# EAGLE design daughterBoard (EAGLE 9.6.2)
PROJECT: This Project
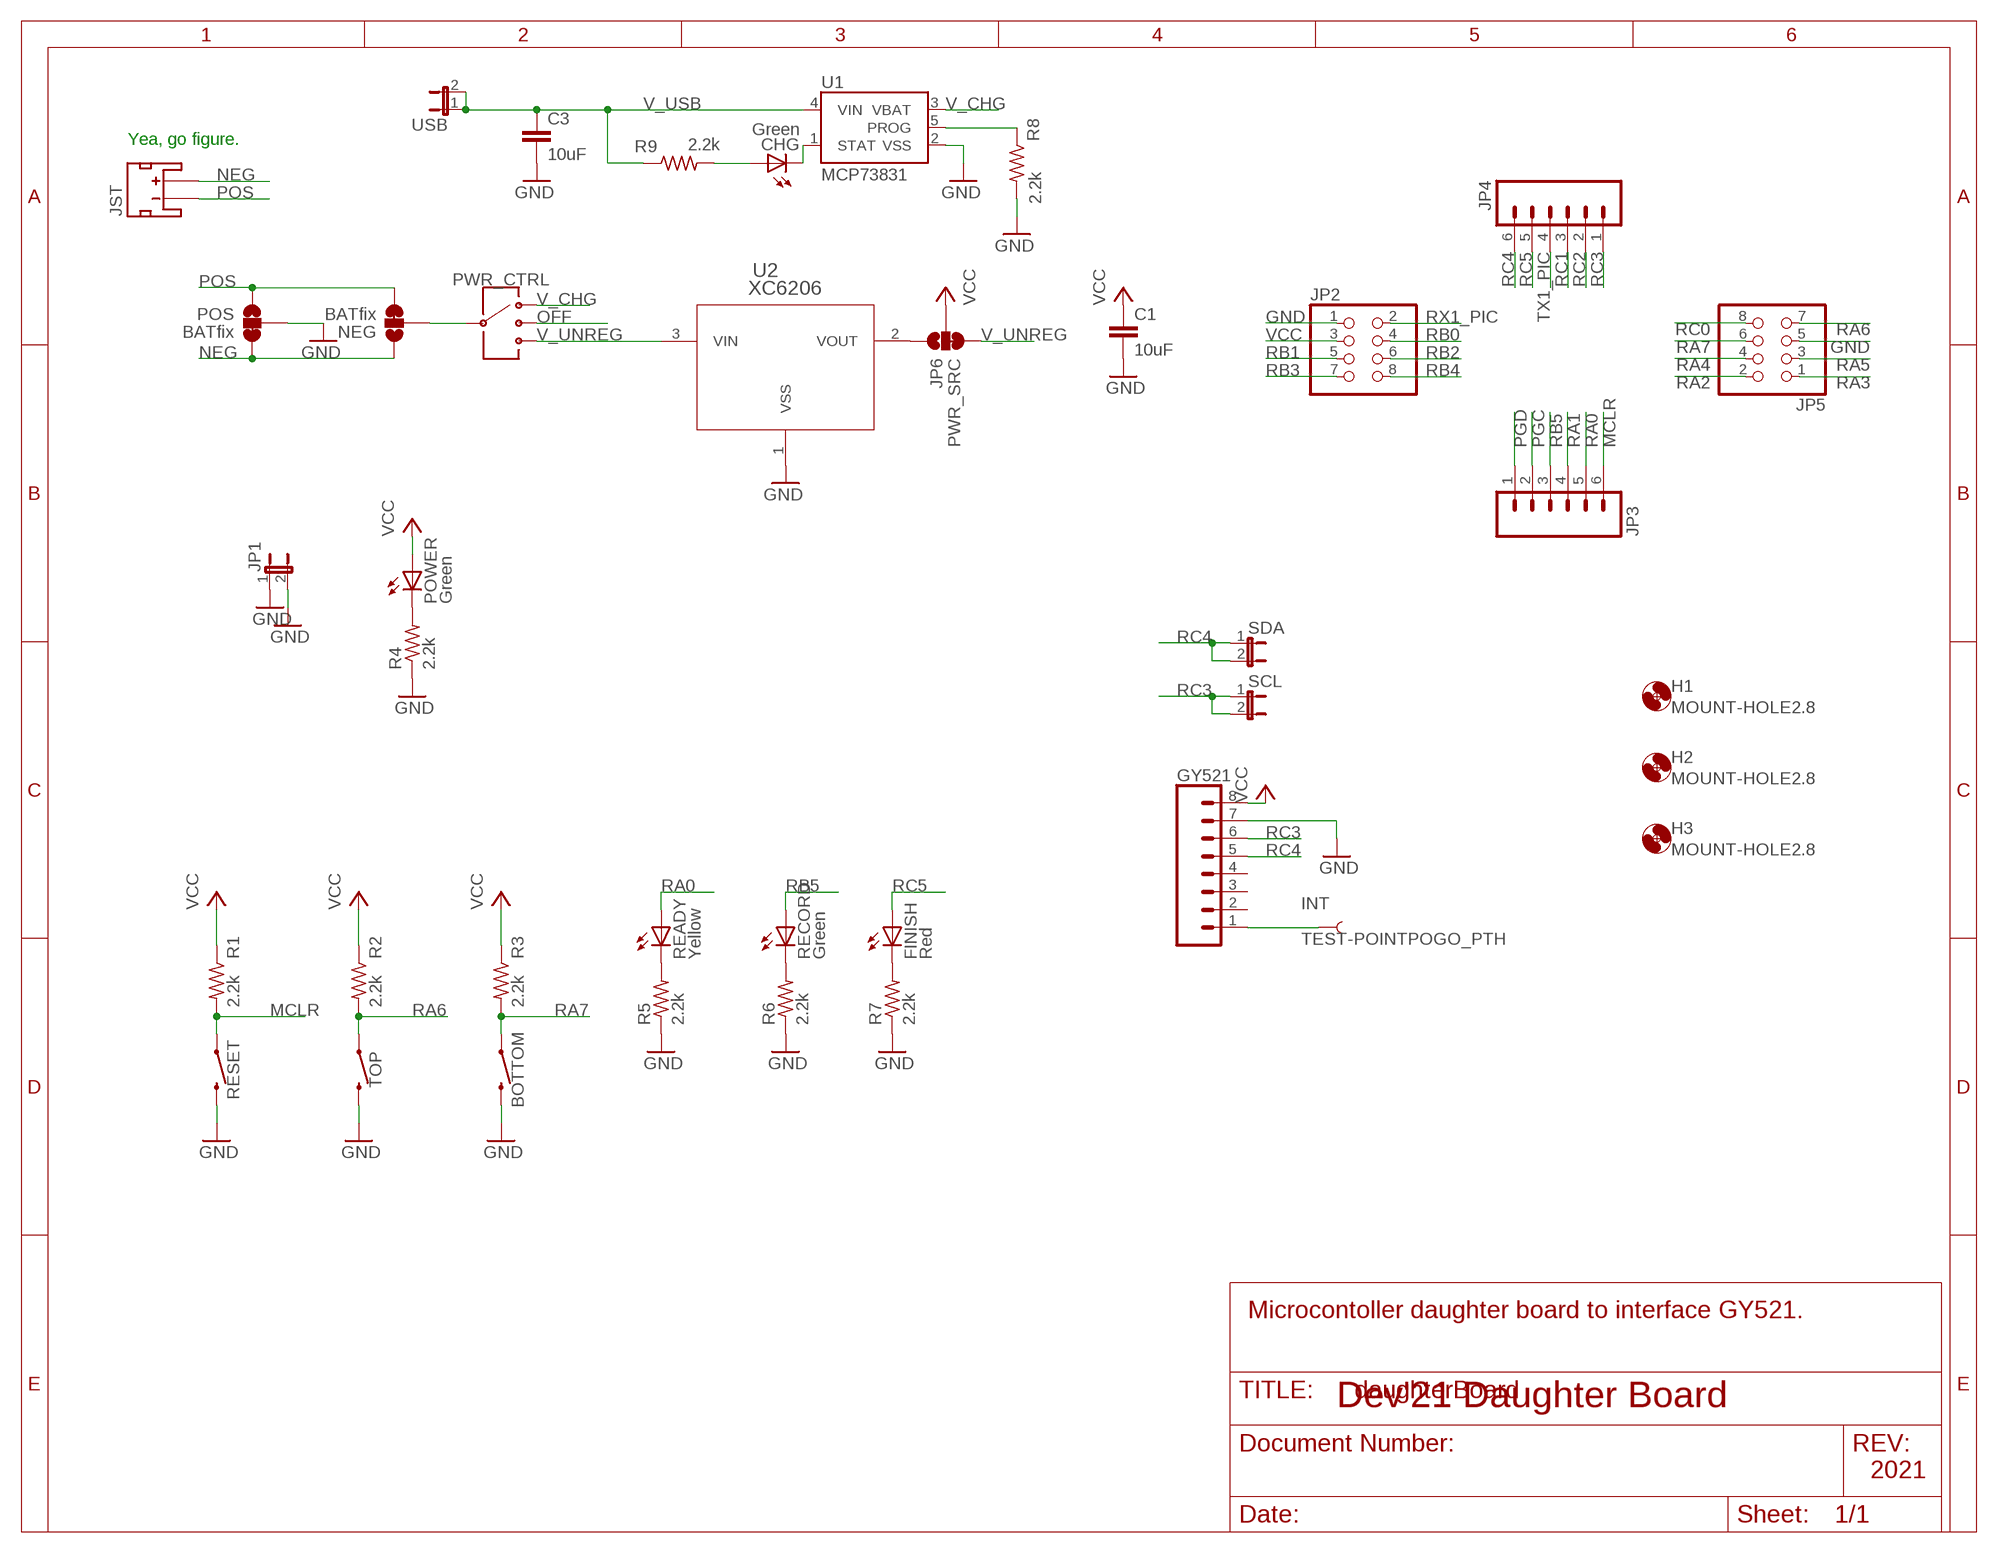
[diagram p0: schematic, sheet 1]

## Parts
BOTTOM  BOTTOM  MOMENTARY-SWITCH-SPST-SMD-5.2MM  [TACTILE_SWITCH_SMD_5.2MM]
C1  10uF  C-EUC1206  [C1206]
C3  10uF  C-EUC1206  [C1206]
CHG  Green  LED1206  [LED-1206]
FINISH  Red  LED1206  [LED-1206]
GY521  CONN_08LOCK_LONGPADS  [1X08_LOCK_LONGPADS]
H1  MOUNT-HOLE2.8  [2,8]
H2  MOUNT-HOLE2.8  [2,8]
H3  MOUNT-HOLE2.8  [2,8]
INT  TEST-POINTPOGO_PTH  [1X01_NO_SILK]
JP1  JP1E  [JP1]
JP2  PINHD-2X4  [2X04]
JP3  M06LOCK  [1X06_LOCK]
JP4  M06LOCK  [1X06_LOCK]
JP5  PINHD-2X4  [2X04]
JP6  PWR_SRC  JUMPER-SMT_3_1-NC_TRACE_SILK  [SMT-JUMPER_3_1-NC_TRACE_SILK]
JST  JST_2MM_MALE  [JST-2-SMD]
NEG  BATfix  JUMPER-SMT_3_1-NC_TRACE_SILK  [SMT-JUMPER_3_1-NC_TRACE_SILK]
POS  BATfix  JUMPER-SMT_3_1-NC_TRACE_SILK  [SMT-JUMPER_3_1-NC_TRACE_SILK]
POWER  Green  LED1206  [LED-1206]
PWR_CTRL  SWITCH-SP3T-SMD  [SWITCH_SP3T_SMD]
R1  2.2k  R-US_R1206  [R1206]
R2  2.2k  R-US_R1206  [R1206]
R3  2.2k  R-US_R1206  [R1206]
R4  2.2k  R-US_R1206  [R1206]
R5  2.2k  R-US_R1206  [R1206]
R6  2.2k  R-US_R1206  [R1206]
R7  2.2k  R-US_R1206  [R1206]
R8  2.2k  R-US_R1206  [R1206]
R9  2.2k  R-US_R1206  [R1206]
READY  Yellow  LED1206  [LED-1206]
RECORD  Green  LED1206  [LED-1206]
RESET  RESET  MOMENTARY-SWITCH-SPST-SMD-5.2MM  [TACTILE_SWITCH_SMD_5.2MM]
SCL  JUMPER-2PTH_LOCK  [1X02_LOCK]
SDA  JUMPER-2PTH_LOCK  [1X02_LOCK]
TOP  TOP  MOMENTARY-SWITCH-SPST-SMD-5.2MM  [TACTILE_SWITCH_SMD_5.2MM]
U1  MCP73831  [SOT23-5]
U2  XC6206  XC6206P332MR-GSOT-23_TOR-M  [SOT-23_TOR-M]
USB  JUMPER-2PTH_LOCK  [1X02_LOCK]

## Nets
GND: BOTTOM.3 C1.2 C3.2 GY521.7 JP1.1 JP1.2 JP2.1 JP5.5 POS.2 R4.1 R5.1 R6.1 R7.1 R8.2 RESET.3 TOP.3 U1.2(VSS) U2.1(VSS)
MCLR: JP3.6 R1.2 RESET.1
N$1: NEG.2 PWR_CTRL.3
N$2: R6.2 RECORD.C
N$3: R5.2 READY.C
N$4: FINISH.C R7.2
N$5: POWER.C R4.2
N$6: GY521.1 INT.1
N$8: JP6.1 U2.2(VOUT)
N$9: CHG.A R9.2
N$10: R8.1 U1.5(PROG)
N$11: CHG.C U1.1(STAT)
NEG: JST.2(+) NEG.1 POS.3
OFF: PWR_CTRL.2
PGC: JP3.2
PGD: JP3.1
POS: JST.1(-) NEG.3 POS.1
RA0: JP3.5 READY.A
RA1: JP3.4
RA2: JP5.2
RA3: JP5.1
RA4: JP5.4
RA5: JP5.3
RA6: JP5.7 R2.2 TOP.1
RA7: BOTTOM.1 JP5.6 R3.2
RB0: JP2.4
RB1: JP2.5
RB2: JP2.6
RB3: JP2.7
RB4: JP2.8
RB5: JP3.3 RECORD.A
RC0: JP5.8
RC1: JP4.3
RC2: JP4.2
RC3: GY521.6 JP4.1 SCL.1 SCL.2
RC4: GY521.5 JP4.6 SDA.1 SDA.2
RC5: FINISH.A JP4.5
RX1_PIC: JP2.2
TX1_PIC: JP4.4
V_CHG: PWR_CTRL.1 U1.3(VBAT)
V_UNREG: JP6.3 PWR_CTRL.4 U2.3(VIN)
V_USB: C3.1 R9.1 U1.4(VIN) USB.1 USB.2
VCC: C1.1 GY521.8 JP2.3 JP6.2 POWER.A R1.1 R2.1 R3.1
Unconnected: GY521.2 GY521.3 GY521.4 JST.NC1(PAD1) JST.NC2(PAD2)

## Notes on the sheet
- Yea, go figure.
- Microcontoller daughter board to interface GY521.
- Dev'21 Daughter Board
- 2021

## Library data of the parts
BOTTOM RESET TOP = SparkFun-Switches:MOMENTARY-SWITCH-SPST: Momentary Switch (Pushbutton) - SPST Normally-open (NO) SPST momentary switches (buttons, pushbuttons). Variants PTH-12MM - 12mm square, through-hole Momentary Pushbutton Switch - 12mm Square <https://www.sparkfun.com/products/9190> (COM-09190) PTH-6.0MM, PTH-6.0MM-KIT - 6.0mm square, through-hole Mini Pushbutton Switch <https://www.sparkfun.com/products/97> (COM-00097) KIT package intended for soldering kit's - only one side of pads' copper is exposed. PTH-RIGHT-ANGLE-KIT - Right-angle, through-hole Right Angle Tactile Button <https://www.sparkfun.com/products/10791> - Used on SparkFun BigTime Watch Kit <https://www.sparkfun.com/products/11734> SMD-12MM - 12mm square, surface-mount Tactile Button - SMD (12mm) <https://www.sparkfun.com/products/12993> (COM-12993) Used on SparkFun PicoBoard <https://www.sparkfun.com/products/11888> SMD-4.5MM - 4.5mm Square Trackball Switch Used on SparkFun Blackberry Trackballer Breakout <https://www.sparkfun.com/products/13169> SMD-4.6MMX2.8MM - 4.60mm x 2.80mm, surface mount Used on SparkFun SAMD21 Mini Breakout <https://www.sparkfun.com/products/13664> SMD-5.2MM, SMD-5.2-REDUNDANT - 5.2mm square, surface-mount Mini Pushbutton Switch - SMD <https://www.sparkfun.com/products/8720> (COM-08720) Used on Arduino Pro Mini <https://www.sparkfun.com/products/11114> REDUNDANT package connects both switch circuits together SMD-6.0X3.5MM - 6.0 x 3.5mm, surface mount Momentary Reset Switch SMD <https://www.sparkfun.com/products/8229> (COM-08229) SMD-6.2MM-TALL - 6.2mm square, surface mount Tactile Button - SMD (6mm) <https://www.sparkfun.com/products/12992> Used on SparkFun Digital Sandbox <https://www.sparkfun.com/products/12651> SMD-RIGHT-ANGLE - Right-angle, surface mount Used on SparkFun Block for Intel® Edison - Arduino <https://www.sparkfun.com/products/13036>; PROD_ID: SWCH-08247; SF_SKU: COM-08720
C1 C3 = rcl:C-EU: CAPACITOR, European symbol; SPICEPREFIX: C
CHG FINISH POWER READY RECORD = SparkFun:LED: LEDs Standard schematic elements and footprints for 5mm, 3mm, 1206, and 0603 sized LEDs. 5mm - Spark Fun Electronics SKU : COM-00529 (and others)
GY521 = SparkFun-Connectors:CONN_08: Multi connection point. Often used as Generic Header-pin footprint for 0.1 inch spaced/style header connections On any of the 0.1 inch spaced packages, you can populate with these: Break Away Headers - Straight <https://www.sparkfun.com/products/116> (PRT-00116) Break Away Male Headers - Right Angle <https://www.sparkfun.com/products/553> (PRT-00553) Female Headers <https://www.sparkfun.com/products/115> (PRT-00115) Break Away Headers - Machine Pin <https://www.sparkfun.com/products/117> (PRT-00117) Break Away Female Headers - Swiss Machine Pin <https://www.sparkfun.com/products/743> (PRT-00743) Arduino Stackable Header - 8 Pin <https://www.sparkfun.com/products/9279> (PRT-09279) For SCREWTERMINALS and SPRING TERMINALS visit here: Screw Terimnals on SparkFun.com <https://www.sparkfun.com/search/results?term=Screw+Terminals> (5mm/3.5mm/2.54mm spacing) This device is also useful as a general connection point to wire up your design to another part of your project. Our various solder wires solder well into these plated through hole pads. Hook-Up Wire - Assortment (Stranded, 22 AWG) <https://www.sparkfun.com/products/11375> (PRT-11375) Hook-Up Wire - Assortment (Solid Core, 22 AWG) <https://www.sparkfun.com/products/11367> (PRT-11367) View the entire wire category on our website here <https://www.sparkfun.com/categories/141> Special notes: Molex polarized connector foot print use with SKU : PRT-08231 with associated crimp pins and housings. 1MM SMD Version SKU: PRT-10208 NOTES ON THE VARIANTS LOCK and LOCK_LONGPADS... This footprint was designed to help hold the alignment of a through-hole component (i.e. 6-pin header) while soldering it into place. You may notice that each hole has been shifted either up or down by 0.005 of an inch from it's more standard position (which is a perfectly straight line). This slight alteration caused the pins (the squares in the middle) to touch the edges of the holes. Because they are alternating, it causes a "brace" to hold the component in place. 0.005 has proven to be the perfect amount of "off-center" position when using our standard breakaway headers. Although looks a little odd when you look at the bare footprint, once you have a header in there, the alteration is very hard to notice. Also,if you push a header all the way into place, it is covered up entirely on the bottom side.
H1-H3 = holes:MOUNT-HOLE: MOUNTING HOLE with drill center marker
INT = SparkFun-Connectors:TEST-POINT: SparkFun Test Points Bare copper test points for troubleshooting or In-Circuit-Testing. These are used by our Production team for verifying production board runs using pogo-pins on test beds. SparkFun Products: SparkFun LSM9DS1 Breakout <https://www.sparkfun.com/products/13284> SparkFun PSOC <https://www.sparkfun.com/products/13714> SparkFun Load Cell Amplifier <https://www.sparkfun.com/products/13879>
JP1 = jumper:JP1E: JUMPER
JP2 JP5 = pinhead:PINHD-2X4: PIN HEADER
JP3 JP4 = SparkFun:M06: Header 6 Standard 6-pin 0.1" header. Use with straight break away headers (SKU : PRT-00116), right angle break away headers (PRT-00553), swiss pins (PRT-00743), machine pins (PRT-00117), and female headers (PRT-00115). Molex polarized connector foot print use with SKU : PRT-08094 with associated crimp pins and housings. NOTES ON THE VARIANTS LOCK and LOCK_LONGPADS... This footprint was designed to help hold the alignment of a through-hole component (i.e. 6-pin header) while soldering it into place. You may notice that each hole has been shifted either up or down by 0.005 of an inch from it's more standard position (which is a perfectly straight line). This slight alteration caused the pins (the squares in the middle) to touch the edges of the holes. Because they are alternating, it causes a "brace" to hold the component in place. 0.005 has proven to be the perfect amount of "off-center" position when using our standard breakaway headers. Although looks a little odd when you look at the bare footprint, once you have a header in there, the alteration is very hard to notice. Also, if you push a header all the way into place, it is covered up entirely on the bottom side. This idea of altering the position of holes to aid alignment will be further integrated into the Sparkfun Library for other footprints. It can help hold any component with 3 or more connection pins.
JP6 NEG POS = SparkFun-Jumpers:JUMPER-SMT_3_1-NC_TRACE: Normally closed trace jumper (1 of 2 connections) This jumper has a trace between two pads so it's normally closed (NC). The other connection is normally open (NO). Use a razor knife to open the connection. For best results follow the IPC guidelines for cutting traces: Cutout at least 0.063 mm (0.005 in). Remove all loose material to clean up the cut area. Seal the cut with an approved epoxy. Reapply solder to reclose the connection, or to close the NO connection.
JST = SparkFun-Connectors:JST_2MM_MALE: JST 2MM MALE RA CONNECTOR Two pin, compact surface mount connector. Commonly used as a battery input connection point. We really like the solid locking feeling and high current rating on these small connectors. We use these all the time as battery connectors. Mates to single-cell LiPo batteries. Here is the connector we sell at SparkFun: JST Right Angle Connector - White <https://www.sparkfun.com/products/8612> (PRT-08612) Datasheet <http://www.sparkfun.com/datasheets/Prototyping/Connectors/JST-Horizontal.pdf> It was used on these SparkFun products: SparkFun MOSFET Power Controller <https://www.sparkfun.com/products/11214> (PRT-11214) SparkFun Battery Babysitter - LiPo Battery Manager <https://www.sparkfun.com/products/13777> (PRT-13777) And many, many others that required a lipo battery connection.; PROD_ID: CONN-11443; SF_ID: PRT-08612
PWR_CTRL = SparkFun-Switches:SWITCH-SP3T: Single-Pole, Triple-Throw (SP3T) Switch Single-Pole, Triple-Throw switches SparkFun Products Prototype Part; PROD_ID: SWCH-10805
R1-R9 = rcl:R-US_: RESISTOR, American symbol; SPICEPREFIX: R
SCL SDA USB = SparkFun-Retired:JUMPER-2: Jumper Basic 0.1" spaced jumper. Use with breakaway headers.
U1 = SparkFun-IC-Power:MCP73831: MCP73831T Li-Ion, Li-Pol Controller Miniature single cell, fully integrated Li-Ion, Li-polymer charge management controller Datasheet <http://ww1.microchip.com/downloads/en/DeviceDoc/20001984g.pdf> SparkFun Products: SparkFun ESP32 Thing <https://www.sparkfun.com/products/13907> SparkFun 9DoF Razor IMU M0 <https://www.sparkfun.com/products/14001>; PROD_ID: IC-09995
U2 = XC6206:XC6206P332MR-G; COPYRIGHT: Copyright (C) 2021 Ultra Librarian. All rights reserved.; MANUFACTURER_PART_NUMBER: XC6206P332MR-G; MFR_NAME: Torex Semiconductor

## Board
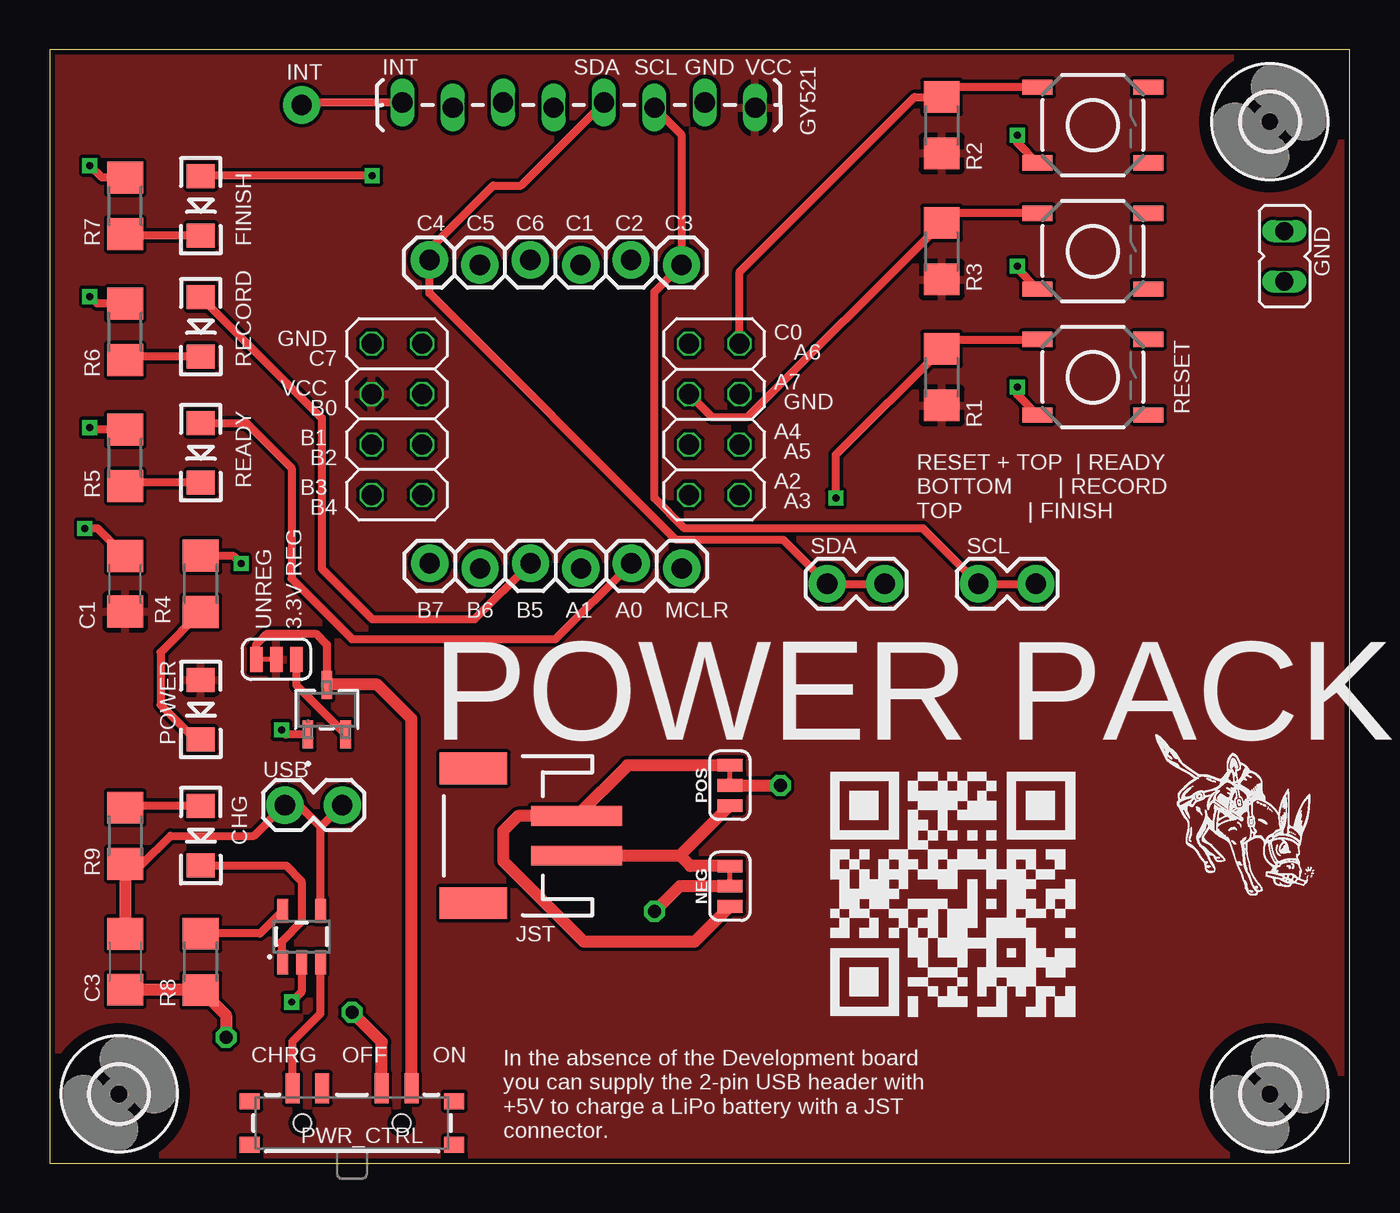
[diagram p1: board, top side]
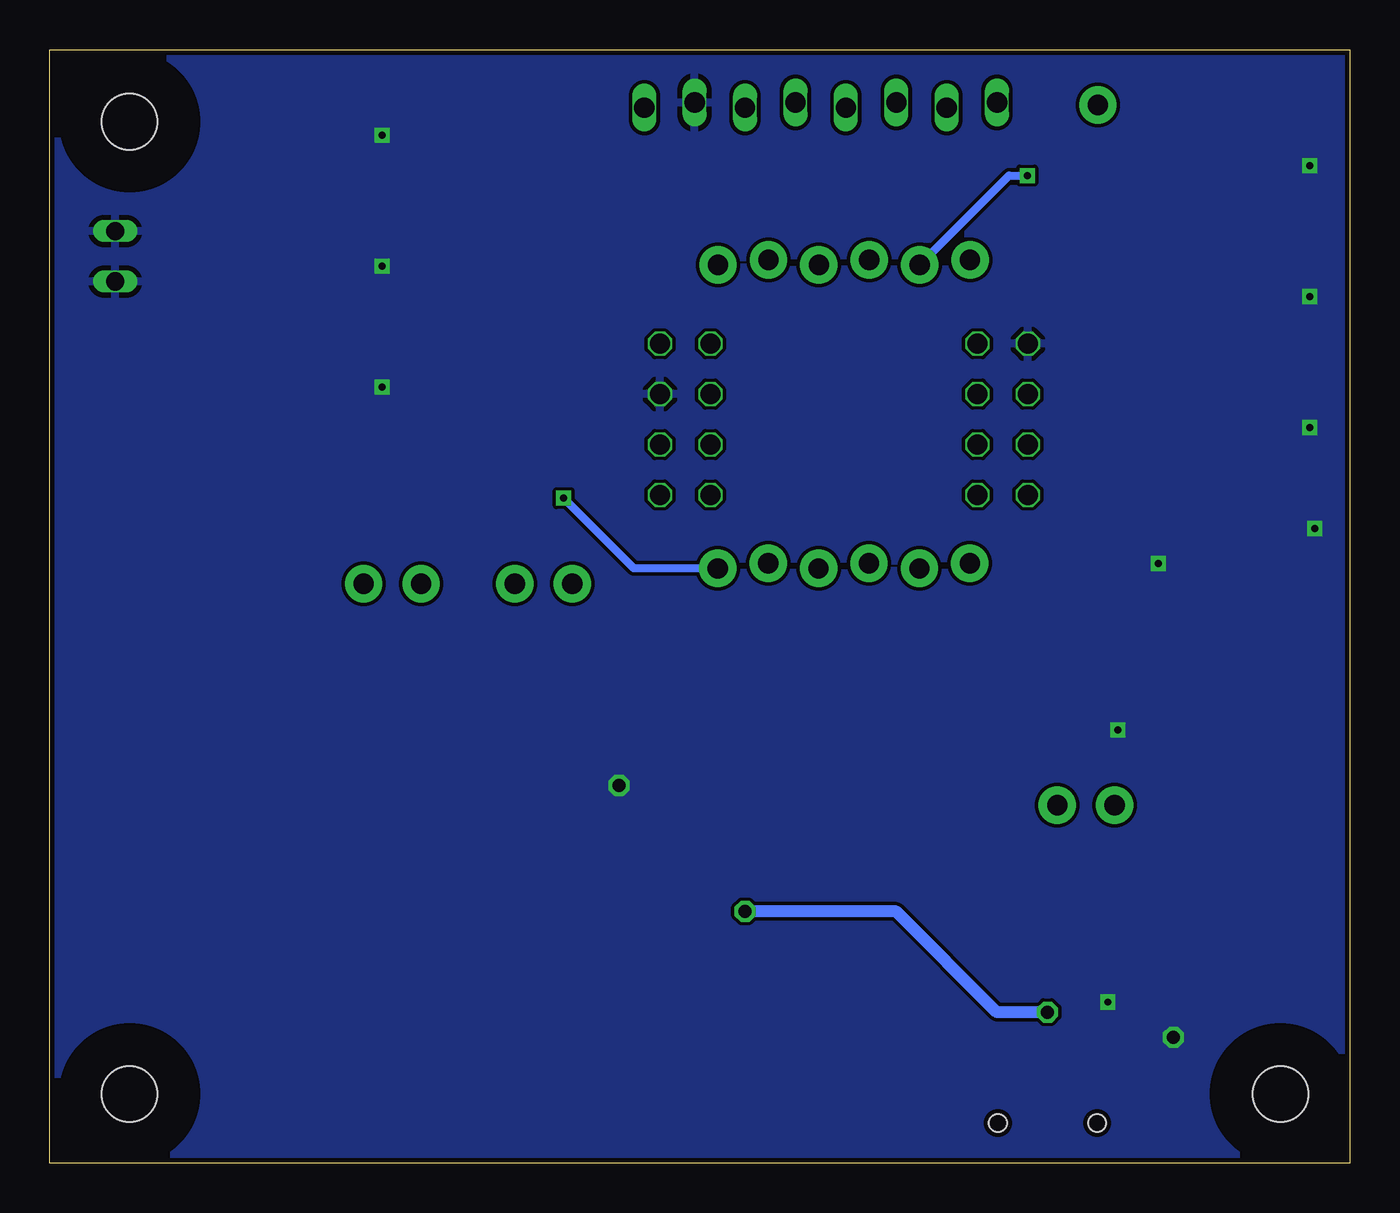
[diagram p2: board, bottom side, seen from below]

Size 65.53 x 56.13 mm. Coordinates in mm from the lower left corner, seen from the top.
Outline: 0,0 65.53,0 65.53,56.13 0,56.13 0,0
Copper layers (1*16): Top 0.0356mm / dielectric 1.5011mm / Bottom 0.0356mm
Design rules "SilverCircuits": minimum track width 7mil, minimum drill 10mil, track to track 7mil, track to pad 7mil, pad to pad 7mil, via to via 7mil, smd to smd 0mil, copper to edge 10mil, drill to drill 10mil, minimum pad ring 4mil, minimum via ring 8mil, stop-mask expansion 4mil, vias tented up to drill 0mil, thermal gap 10mil

### Footprints (pad centres in the part's own frame; a part is rotated, then mirrored left to right if it is on the bottom)
TACTILE_SWITCH_SMD_5.2MM = smd 1.524 x 0.762: 1 -2.794,1.905; 2 2.794,1.905; 3 -2.794,-1.905; 4 2.794,-1.905
C1206 = smd 1.6 x 1.8: 1 -1.4,0; 2 1.4,0
LED-1206 = smd 1.2 x 1.4: A -1.5,0; C 1.5,0
1X08_LOCK_LONGPADS = drill 1.016 long: 1 0,0.127; 2 2.54,-0.127; 3 5.08,0.127; 4 7.62,-0.127; 5 10.16,0.127; 6 12.7,-0.127; 7 15.24,0.127; 8 17.78,-0.127
2,8 = hole 2.8: 0,0
1X01_NO_SILK = drill 1.016 pad 1.88: 1 0,0
JP1 = drill 0.914 long: 1 0,-1.27; 2 0,1.27
2X04 = drill 1.016 octagon: 1 -3.81,-1.27; 2 -3.81,1.27; 3 -1.27,-1.27; 4 -1.27,1.27; 5 1.27,-1.27; 6 1.27,1.27; 7 3.81,-1.27; 8 3.81,1.27
1X06_LOCK = drill 1.016 pad 1.88: 1 0,0; 2 2.54,-0.254; 3 5.08,0; 4 7.62,-0.254; 5 10.16,0; 6 12.7,-0.254
SMT-JUMPER_3_1-NC_TRACE_SILK = smd 0.635 x 1.27: 1 -1.016,0; 2 0,0; 3 1.016,0
JST-2-SMD = smd 1 x 4.6: 1 -1,-3.7; 2 1,-3.7 | smd 1.6 x 3.4: NC1 -3.4,1.5; NC2 3.4,1.5
SWITCH_SP3T_SMD = smd 0.7 x 1.5: 1 3,-1.75; 2 1.5,-1.75; 3 -1.5,-1.75; 4 -3,-1.75 | smd 1 x 0.8: P$1 -5.15,-1.1; P$2 -5.15,1.1; P$3 5.15,1.1; P$4 5.15,-1.1 | hole 0.9: 2.5,0; -2.5,0
R1206 = smd 1.6 x 1.803: 1 -1.422,0; 2 1.422,0
1X02_LOCK = drill 1.016 pad 1.88: 1 -0.178,0; 2 2.718,0
SOT23-5 = smd 0.55 x 1.2: 1 -0.95,-1.3; 2 0,-1.3; 3 0.95,-1.3; 4 0.95,1.3; 5 -0.95,1.3
SOT-23_TOR-M = smd 0.533 x 1.422: 1 -0.95,-1.245; 2 0.95,-1.245; 3 0,1.245

### Placement (x,y rotation side)
BOTTOM  52.58,45.97 0 top
C1  3.81,29.21 90 top
C3  3.81,10.16 270 top
CHG  7.62,16.51 270 top
FINISH  7.62,48.26 270 top
GY521  17.78,53.34 0 top
H1  61.5,3.5 0 top
H2  61.5,52.5 0 top
H3  3.5,3.5 0 top
INT  12.7,53.34 0 top
JP1  62.23,45.72 0 top
JP2  17.5,37.5 270 top
JP3  19.16,30.24 0 top
JP4  31.84,45.28 180 top
JP5  33.5,37.5 90 top
JP6  11.43,25.4 180 top
JST  22.86,16.51 90 top
NEG  34.29,13.97 90 top
POS  34.29,19.05 90 top
POWER  7.62,22.86 270 top
PWR_CTRL  15.24,2.03 180 top
R1  44.96,39.62 90 top
R2  44.96,52.32 90 top
R3  44.96,45.97 90 top
R4  7.62,29.21 270 top
R5  3.81,35.56 270 top
R6  3.81,41.91 270 top
R7  3.81,48.26 270 top
R8  7.62,10.16 270 top
R9  3.81,16.51 90 top
READY  7.62,35.81 270 top
RECORD  7.62,42.16 270 top
RESET  52.58,39.62 0 top
SCL  46.99,29.21 0 top
SDA  39.37,29.21 0 top
TOP  52.58,52.32 0 top
U1  12.7,11.43 0 top
U2  13.97,22.86 0 top
USB  12.03,18.06 0 top

### Tracks (layer width: path | path; a pad name or v marks a point on that pad's centre or on a via)
GND  (via drill 0.35, 0.65)
  Top 0.406: R5.1 2.13,36.98 v2.03,37.08 | R6.1 2.39,43.33 v2.03,43.69 | R7.1 2.64,49.68 v2.03,50.29 | TOP.3 48.77,51.44 v48.77,51.82 | BOTTOM.3 48.77,45.09 v48.77,45.21 | RESET.3 48.77,38.73 v48.77,39.12 | U1.2 12.7,8.64 v12.19,8.13 | C1.2 2.42,32 v1.78,32 | R4.1 9.25,30.63 v9.65,30.23 | U2.1 11.91,21.61 v11.68,21.84
  Top 0.61: POS.2 v36.83,19.05 | C3.2 7.6,8.76 R8.2 8.89,7.47 v8.89,6.35
  pour Bottom: 0,0 65.53,0 65.53,56.13 0,56.13
MCLR  (via drill 0.35)
  Top 0.406: RESET.1 45.44,41.53 R1.2 39.62,35.71 v39.62,33.53
  Bottom 0.406: JP3.6 36.08,29.99 v39.62,33.53
N$1  (via drill 0.65)
  Top 0.61: PWR_CTRL.3 16.74,6.12 v15.24,7.62 | NEG.2 31.75,13.97 v30.48,12.7
  Bottom 0.61: v30.48,12.7 22.86,12.7 17.78,7.62 v15.24,7.62
N$2
  Top 0.406: RECORD.C 3.99,40.66 R6.2
N$3
  Top 0.406: READY.C 3.99,34.31 R5.2
N$4
  Top 0.406: FINISH.C 3.89,46.76 R7.2
N$5
  Top 0.406: R4.2 5.59,25.76 5.59,23.11 7.34,21.36 POWER.C
N$6
  Top 0.406: GY521.1 12.83,53.47 INT.1
N$8
  Top 0.406: U2.2 12.45,24.09 JP6.1
N$9
  Top 0.406: CHG.A 3.89,18.01 R9.2
N$10
  Top 0.406: U1.5 10.6,11.58 R8.1
N$11
  Top 0.406: CHG.C 11.91,15.01 12.7,14.22 12.7,12.19 11.68,11.18 11.68,10.2 U1.1
NEG
  Top 0.406: POS.3 33.68,20.07
  Top 0.61: 33.68,20.07 29.12,20.07 JST.2 23.61,17.51 22.86,16.76 22.86,15.24 26.92,11.18 32.51,11.18 NEG.1
POS
  Top 0.61: JST.1 31.77,15.51 | 31.77,15.51 POS.1 | NEG.3 32.29,14.99 31.77,15.51
RA0
  Top 0.406: READY.A 9.93,37.31 12.19,35.05 12.19,29.46 15.24,26.42 25.49,26.42 JP3.5
RA6
  Top 0.406: TOP.1 45.44,54.23 R2.2 43.59,53.75 34.77,44.93 JP5.7
RA7
  Top 0.406: JP5.6 33.41,37.59 35.15,37.59 R3.2 45.44,47.88 BOTTOM.1
RB5
  Top 0.406: RECORD.A 13.72,37.57 13.72,29.97 16.26,27.43 21.43,27.43 JP3.3
RC3
  Top 0.406: GY521.6 31.84,51.85 JP4.1 30.48,43.91 30.48,33.53 32,32 44.02,32 SCL.1 SCL.2
RC4
  Top 0.406: GY521.5 23.75,49.28 22.35,49.28 19.14,46.07 JP4.6 19.14,43.85 31.57,31.42 36.98,31.42 SDA.1 SDA.2
RC5  (via drill 0.35)
  Top 0.406: v16.26,49.78 7.64,49.78 FINISH.A
  Bottom 0.406: JP4.5 17.18,49.78 v16.26,49.78
V_CHG
  Top 0.406: U1.3 13.65,7.55 12.24,6.14 PWR_CTRL.1
V_UNREG
  Top 0.406: U2.3 13.97,24.13 13.97,26.16 13.46,26.67 10.92,26.67 10.54,26.29 10.41,26.16 JP6.3
  Top 0.61: 13.97,24.13 16.51,24.13 18.24,22.4 PWR_CTRL.4
V_USB
  Top 0.406: R9.1 4.67,15.09 6.1,16.51 10.31,16.51 USB.1 12.55,18.06 13.65,16.96 | 13.65,16.96 USB.2 | U1.4 13.65,16.96
  Top 0.61: R9.1 C3.1
VCC
  pour Top (rank 4): 0,0 65.53,0 65.53,56.13 0,56.13

### Text on the board
tPlace: INT | SDA | SCL | GND | VCC | C4 | C5 | C6 | C1 | C2 | C3 | GND | GND | C0 | C7 | VCC | A6 | A7 | B0 | GND | B1 | B2 | A4 | A5 | B3 | B4 | A2 | A3 | RESET + TOP | READY / BOTTOM | RECORD / TOP | FINISH | B7 | B6 | B5 | A1 | A0 | MCLR | UNREG | 3.3V REG | POWER PACK | CHRG | OFF | ON | In the absence of the Development board / you can supply the 2-pin USB header with / +5V to charge a LiPo battery with a JST / connector.